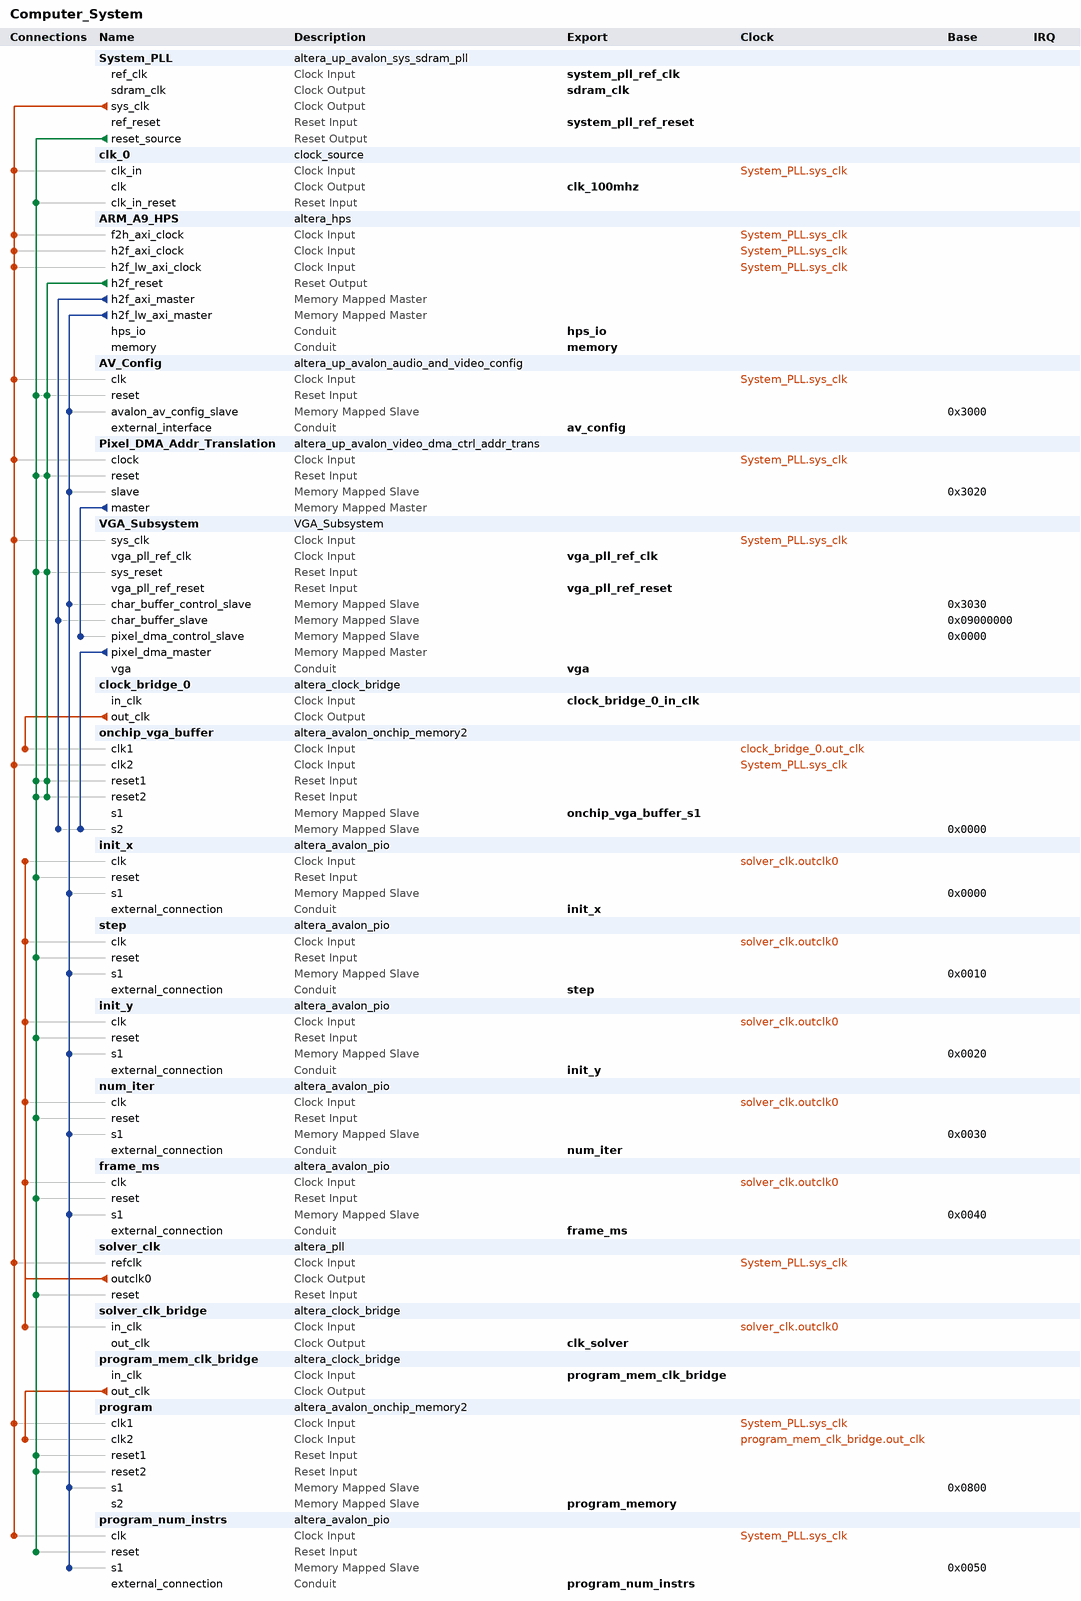
[diagram p0: system contents]
# Platform Designer (Qsys) system Computer_System, Cyclone V 5CSEMA5F31C6
# Parameters at their usual value, and those the tool derives, are not listed.
package require -exact qsys 16.1
create_system Computer_System
set_project_property DEVICE_FAMILY {Cyclone V}
set_project_property DEVICE 5CSEMA5F31C6

add_instance System_PLL altera_up_avalon_sys_sdram_pll 16.1
set_instance_parameter_value System_PLL CV_boards DE1-SoC
set_instance_parameter_value System_PLL gui_outclk 100.0
set_instance_parameter_value System_PLL gui_refclk 50.0

add_instance clk_0 clock_source 16.1
set_instance_parameter_value clk_0 clockFrequency 100000000

add_instance ARM_A9_HPS altera_hps 16.1
set_instance_parameter_value ARM_A9_HPS EMAC1_Mode RGMII
set_instance_parameter_value ARM_A9_HPS EMAC1_PinMuxing {HPS I/O Set 0}
set_instance_parameter_value ARM_A9_HPS F2SCLK_COLDRST_Enable false
set_instance_parameter_value ARM_A9_HPS F2SCLK_DBGRST_Enable false
set_instance_parameter_value ARM_A9_HPS F2SCLK_WARMRST_Enable false
set_instance_parameter_value ARM_A9_HPS F2SINTERRUPT_Enable true
set_instance_parameter_value ARM_A9_HPS F2S_Width 2
set_instance_parameter_value ARM_A9_HPS FPGA_PERIPHERAL_OUTPUT_CLOCK_FREQ_EMAC0_GTX_CLK 125
set_instance_parameter_value ARM_A9_HPS FPGA_PERIPHERAL_OUTPUT_CLOCK_FREQ_EMAC0_MD_CLK 100.0
set_instance_parameter_value ARM_A9_HPS FPGA_PERIPHERAL_OUTPUT_CLOCK_FREQ_EMAC1_GTX_CLK 125
set_instance_parameter_value ARM_A9_HPS FPGA_PERIPHERAL_OUTPUT_CLOCK_FREQ_EMAC1_MD_CLK 100.0
set_instance_parameter_value ARM_A9_HPS HPS_PROTOCOL DDR3
set_instance_parameter_value ARM_A9_HPS I2C0_Mode I2C
set_instance_parameter_value ARM_A9_HPS I2C0_PinMuxing {HPS I/O Set 0}
set_instance_parameter_value ARM_A9_HPS I2C1_Mode I2C
set_instance_parameter_value ARM_A9_HPS I2C1_PinMuxing {HPS I/O Set 0}
set_instance_parameter_value ARM_A9_HPS LWH2F_Enable true
set_instance_parameter_value ARM_A9_HPS MEM_BANKADDR_WIDTH 3
set_instance_parameter_value ARM_A9_HPS MEM_CLK_FREQ 400.0
set_instance_parameter_value ARM_A9_HPS MEM_COL_ADDR_WIDTH 10
set_instance_parameter_value ARM_A9_HPS MEM_DQ_WIDTH 32
set_instance_parameter_value ARM_A9_HPS MEM_DRV_STR RZQ/7
set_instance_parameter_value ARM_A9_HPS MEM_ROW_ADDR_WIDTH 15
set_instance_parameter_value ARM_A9_HPS MEM_RTT_NOM RZQ/4
set_instance_parameter_value ARM_A9_HPS MEM_RTT_WR RZQ/4
set_instance_parameter_value ARM_A9_HPS MEM_TCL 11
set_instance_parameter_value ARM_A9_HPS MEM_TFAW_NS 30.0
set_instance_parameter_value ARM_A9_HPS MEM_TRAS_NS 35.0
set_instance_parameter_value ARM_A9_HPS MEM_TRCD_NS 13.75
set_instance_parameter_value ARM_A9_HPS MEM_TRFC_NS 260.0
set_instance_parameter_value ARM_A9_HPS MEM_TRP_NS 13.75
set_instance_parameter_value ARM_A9_HPS MEM_VENDOR JEDEC
set_instance_parameter_value ARM_A9_HPS MEM_WTCL 8
set_instance_parameter_value ARM_A9_HPS QSPI_Mode {1 SS}
set_instance_parameter_value ARM_A9_HPS QSPI_PinMuxing {HPS I/O Set 0}
set_instance_parameter_value ARM_A9_HPS REF_CLK_FREQ 25.0
set_instance_parameter_value ARM_A9_HPS S2FCLK_USER2CLK 5
set_instance_parameter_value ARM_A9_HPS S2F_Width 3
set_instance_parameter_value ARM_A9_HPS SDIO_Mode {4-bit Data}
set_instance_parameter_value ARM_A9_HPS SDIO_PinMuxing {HPS I/O Set 0}
set_instance_parameter_value ARM_A9_HPS SPIM1_Mode {Single Slave Select}
set_instance_parameter_value ARM_A9_HPS SPIM1_PinMuxing {HPS I/O Set 0}
set_instance_parameter_value ARM_A9_HPS STM_Enable false
set_instance_parameter_value ARM_A9_HPS TIMING_BOARD_AC_SKEW 0.03
set_instance_parameter_value ARM_A9_HPS TIMING_BOARD_AC_TO_CK_SKEW 0.0
set_instance_parameter_value ARM_A9_HPS TIMING_BOARD_DQ_TO_DQS_SKEW 0.0
set_instance_parameter_value ARM_A9_HPS TIMING_BOARD_MAX_CK_DELAY 0.03
set_instance_parameter_value ARM_A9_HPS TIMING_BOARD_MAX_DQS_DELAY 0.02
set_instance_parameter_value ARM_A9_HPS TIMING_BOARD_SKEW_BETWEEN_DQS 0.08
set_instance_parameter_value ARM_A9_HPS TIMING_BOARD_SKEW_CKDQS_DIMM_MAX 0.16
set_instance_parameter_value ARM_A9_HPS TIMING_BOARD_SKEW_CKDQS_DIMM_MIN 0.09
set_instance_parameter_value ARM_A9_HPS TIMING_BOARD_SKEW_WITHIN_DQS 0.01
set_instance_parameter_value ARM_A9_HPS TIMING_TDH 65
set_instance_parameter_value ARM_A9_HPS TIMING_TDQSCK 255
set_instance_parameter_value ARM_A9_HPS TIMING_TDQSQ 125
set_instance_parameter_value ARM_A9_HPS TIMING_TDS 30
set_instance_parameter_value ARM_A9_HPS TIMING_TIH 140
set_instance_parameter_value ARM_A9_HPS TIMING_TIS 180
set_instance_parameter_value ARM_A9_HPS TIMING_TQSH 0.4
set_instance_parameter_value ARM_A9_HPS UART0_Mode {No Flow Control}
set_instance_parameter_value ARM_A9_HPS UART0_PinMuxing {HPS I/O Set 0}
set_instance_parameter_value ARM_A9_HPS USB1_Mode SDR
set_instance_parameter_value ARM_A9_HPS USB1_PinMuxing {HPS I/O Set 0}
set_instance_parameter_value ARM_A9_HPS desired_cfg_clk_mhz 100.0
set_instance_parameter_value ARM_A9_HPS desired_qspi_clk_mhz 400.0

add_instance AV_Config altera_up_avalon_audio_and_video_config 16.1
set_instance_parameter_value AV_Config audio_in {Microphone to ADC}
set_instance_parameter_value AV_Config bit_length 32
set_instance_parameter_value AV_Config board DE1-SoC
set_instance_parameter_value AV_Config line_in_bypass false
set_instance_parameter_value AV_Config sampling_rate {48 kHz}

add_instance Pixel_DMA_Addr_Translation altera_up_avalon_video_dma_ctrl_addr_trans 16.1

add_instance VGA_Subsystem VGA_Subsystem 1.0

add_instance clock_bridge_0 altera_clock_bridge 16.1
set_instance_parameter_value clock_bridge_0 DERIVED_CLOCK_RATE 0
set_instance_parameter_value clock_bridge_0 EXPLICIT_CLOCK_RATE 100000000

add_instance onchip_vga_buffer altera_avalon_onchip_memory2 16.1
set_instance_parameter_value onchip_vga_buffer dataWidth 8
set_instance_parameter_value onchip_vga_buffer dualPort true
set_instance_parameter_value onchip_vga_buffer initMemContent false
set_instance_parameter_value onchip_vga_buffer initializationFileName onchip_mem.hex
set_instance_parameter_value onchip_vga_buffer memorySize 307200

add_instance init_x altera_avalon_pio 16.1
set_instance_parameter_value init_x direction Output
set_instance_parameter_value init_x resetValue 100663296
set_instance_parameter_value init_x width 27

add_instance step altera_avalon_pio 16.1
set_instance_parameter_value step direction Output
set_instance_parameter_value step resetValue 31195136
set_instance_parameter_value step width 27

add_instance init_y altera_avalon_pio 16.1
set_instance_parameter_value init_y direction Output
set_instance_parameter_value init_y resetValue 100401152
set_instance_parameter_value init_y width 27

add_instance num_iter altera_avalon_pio 16.1
set_instance_parameter_value num_iter direction Output
set_instance_parameter_value num_iter resetValue 1000
set_instance_parameter_value num_iter width 10

add_instance frame_ms altera_avalon_pio 16.1
set_instance_parameter_value frame_ms direction Input
set_instance_parameter_value frame_ms width 32

add_instance solver_clk altera_pll 16.1
set_instance_parameter_value solver_clk gui_device_speed_grade 1
set_instance_parameter_value solver_clk gui_number_of_clocks 1
set_instance_parameter_value solver_clk gui_operation_mode direct
set_instance_parameter_value solver_clk gui_output_clock_frequency0 50.0
set_instance_parameter_value solver_clk gui_pll_mode {Integer-N PLL}
set_instance_parameter_value solver_clk gui_reference_clock_frequency 100.0
set_instance_parameter_value solver_clk gui_use_locked false

add_instance solver_clk_bridge altera_clock_bridge 16.1
set_instance_parameter_value solver_clk_bridge DERIVED_CLOCK_RATE 50000000
set_instance_parameter_value solver_clk_bridge EXPLICIT_CLOCK_RATE 50000000

add_instance program_mem_clk_bridge altera_clock_bridge 16.1
set_instance_parameter_value program_mem_clk_bridge DERIVED_CLOCK_RATE 0
set_instance_parameter_value program_mem_clk_bridge EXPLICIT_CLOCK_RATE 100000000

add_instance program altera_avalon_onchip_memory2 16.1
set_instance_parameter_value program dataWidth 128
set_instance_parameter_value program dualPort true
set_instance_parameter_value program initMemContent true
set_instance_parameter_value program initializationFileName onchip_mem.hex
set_instance_parameter_value program memorySize 1500

add_instance program_num_instrs altera_avalon_pio 16.1
set_instance_parameter_value program_num_instrs direction Input
set_instance_parameter_value program_num_instrs width 32

# connections
add_connection clock_bridge_0.out_clk onchip_vga_buffer.clk1 clock
add_connection program_mem_clk_bridge.out_clk program.clk2 clock
add_connection solver_clk.outclk0 frame_ms.clk clock
add_connection solver_clk.outclk0 init_x.clk clock
add_connection solver_clk.outclk0 init_y.clk clock
add_connection solver_clk.outclk0 num_iter.clk clock
add_connection solver_clk.outclk0 solver_clk_bridge.in_clk clock
add_connection solver_clk.outclk0 step.clk clock
add_connection System_PLL.sys_clk ARM_A9_HPS.f2h_axi_clock clock
add_connection System_PLL.sys_clk ARM_A9_HPS.h2f_axi_clock clock
add_connection System_PLL.sys_clk ARM_A9_HPS.h2f_lw_axi_clock clock
add_connection System_PLL.sys_clk AV_Config.clk clock
add_connection System_PLL.sys_clk clk_0.clk_in clock
add_connection System_PLL.sys_clk onchip_vga_buffer.clk2 clock
add_connection System_PLL.sys_clk Pixel_DMA_Addr_Translation.clock clock
add_connection System_PLL.sys_clk program.clk1 clock
add_connection System_PLL.sys_clk program_num_instrs.clk clock
add_connection System_PLL.sys_clk solver_clk.refclk clock
add_connection System_PLL.sys_clk VGA_Subsystem.sys_clk clock
add_connection ARM_A9_HPS.h2f_reset AV_Config.reset reset
add_connection ARM_A9_HPS.h2f_reset onchip_vga_buffer.reset1 reset
add_connection ARM_A9_HPS.h2f_reset onchip_vga_buffer.reset2 reset
add_connection ARM_A9_HPS.h2f_reset Pixel_DMA_Addr_Translation.reset reset
add_connection ARM_A9_HPS.h2f_reset VGA_Subsystem.sys_reset reset
add_connection System_PLL.reset_source AV_Config.reset reset
add_connection System_PLL.reset_source clk_0.clk_in_reset reset
add_connection System_PLL.reset_source frame_ms.reset reset
add_connection System_PLL.reset_source init_x.reset reset
add_connection System_PLL.reset_source init_y.reset reset
add_connection System_PLL.reset_source num_iter.reset reset
add_connection System_PLL.reset_source onchip_vga_buffer.reset1 reset
add_connection System_PLL.reset_source onchip_vga_buffer.reset2 reset
add_connection System_PLL.reset_source Pixel_DMA_Addr_Translation.reset reset
add_connection System_PLL.reset_source program.reset1 reset
add_connection System_PLL.reset_source program.reset2 reset
add_connection System_PLL.reset_source program_num_instrs.reset reset
add_connection System_PLL.reset_source solver_clk.reset reset
add_connection System_PLL.reset_source step.reset reset
add_connection System_PLL.reset_source VGA_Subsystem.sys_reset reset
add_connection ARM_A9_HPS.h2f_axi_master onchip_vga_buffer.s2 avalon
set_connection_parameter_value ARM_A9_HPS.h2f_axi_master/onchip_vga_buffer.s2 baseAddress 0x0000
add_connection ARM_A9_HPS.h2f_axi_master VGA_Subsystem.char_buffer_slave avalon
set_connection_parameter_value ARM_A9_HPS.h2f_axi_master/VGA_Subsystem.char_buffer_slave baseAddress 0x09000000
add_connection ARM_A9_HPS.h2f_lw_axi_master AV_Config.avalon_av_config_slave avalon
set_connection_parameter_value ARM_A9_HPS.h2f_lw_axi_master/AV_Config.avalon_av_config_slave baseAddress 0x3000
add_connection ARM_A9_HPS.h2f_lw_axi_master frame_ms.s1 avalon
set_connection_parameter_value ARM_A9_HPS.h2f_lw_axi_master/frame_ms.s1 baseAddress 0x0040
add_connection ARM_A9_HPS.h2f_lw_axi_master init_x.s1 avalon
set_connection_parameter_value ARM_A9_HPS.h2f_lw_axi_master/init_x.s1 baseAddress 0x0000
add_connection ARM_A9_HPS.h2f_lw_axi_master init_y.s1 avalon
set_connection_parameter_value ARM_A9_HPS.h2f_lw_axi_master/init_y.s1 baseAddress 0x0020
add_connection ARM_A9_HPS.h2f_lw_axi_master num_iter.s1 avalon
set_connection_parameter_value ARM_A9_HPS.h2f_lw_axi_master/num_iter.s1 baseAddress 0x0030
add_connection ARM_A9_HPS.h2f_lw_axi_master Pixel_DMA_Addr_Translation.slave avalon
set_connection_parameter_value ARM_A9_HPS.h2f_lw_axi_master/Pixel_DMA_Addr_Translation.slave baseAddress 0x3020
add_connection ARM_A9_HPS.h2f_lw_axi_master program.s1 avalon
set_connection_parameter_value ARM_A9_HPS.h2f_lw_axi_master/program.s1 baseAddress 0x0800
add_connection ARM_A9_HPS.h2f_lw_axi_master program_num_instrs.s1 avalon
set_connection_parameter_value ARM_A9_HPS.h2f_lw_axi_master/program_num_instrs.s1 baseAddress 0x0050
add_connection ARM_A9_HPS.h2f_lw_axi_master step.s1 avalon
set_connection_parameter_value ARM_A9_HPS.h2f_lw_axi_master/step.s1 baseAddress 0x0010
add_connection ARM_A9_HPS.h2f_lw_axi_master VGA_Subsystem.char_buffer_control_slave avalon
set_connection_parameter_value ARM_A9_HPS.h2f_lw_axi_master/VGA_Subsystem.char_buffer_control_slave baseAddress 0x3030
add_connection Pixel_DMA_Addr_Translation.master VGA_Subsystem.pixel_dma_control_slave avalon
set_connection_parameter_value Pixel_DMA_Addr_Translation.master/VGA_Subsystem.pixel_dma_control_slave baseAddress 0x0000
add_connection VGA_Subsystem.pixel_dma_master onchip_vga_buffer.s2 avalon
set_connection_parameter_value VGA_Subsystem.pixel_dma_master/onchip_vga_buffer.s2 baseAddress 0x0000

# exported interfaces
add_interface av_config conduit end
set_interface_property av_config EXPORT_OF AV_Config.external_interface
add_interface clk_100mhz clock source
set_interface_property clk_100mhz EXPORT_OF clk_0.clk
add_interface clk_solver clock source
set_interface_property clk_solver EXPORT_OF solver_clk_bridge.out_clk
add_interface clock_bridge_0_in_clk clock sink
set_interface_property clock_bridge_0_in_clk EXPORT_OF clock_bridge_0.in_clk
add_interface frame_ms conduit end
set_interface_property frame_ms EXPORT_OF frame_ms.external_connection
add_interface hps_io conduit end
set_interface_property hps_io EXPORT_OF ARM_A9_HPS.hps_io
add_interface init_x conduit end
set_interface_property init_x EXPORT_OF init_x.external_connection
add_interface init_y conduit end
set_interface_property init_y EXPORT_OF init_y.external_connection
add_interface memory conduit end
set_interface_property memory EXPORT_OF ARM_A9_HPS.memory
add_interface num_iter conduit end
set_interface_property num_iter EXPORT_OF num_iter.external_connection
add_interface onchip_vga_buffer_s1 avalon slave
set_interface_property onchip_vga_buffer_s1 EXPORT_OF onchip_vga_buffer.s1
add_interface program_mem_clk_bridge clock sink
set_interface_property program_mem_clk_bridge EXPORT_OF program_mem_clk_bridge.in_clk
add_interface program_memory avalon slave
set_interface_property program_memory EXPORT_OF program.s2
add_interface program_num_instrs conduit end
set_interface_property program_num_instrs EXPORT_OF program_num_instrs.external_connection
add_interface sdram_clk clock source
set_interface_property sdram_clk EXPORT_OF System_PLL.sdram_clk
add_interface step conduit end
set_interface_property step EXPORT_OF step.external_connection
add_interface system_pll_ref_clk clock sink
set_interface_property system_pll_ref_clk EXPORT_OF System_PLL.ref_clk
add_interface system_pll_ref_reset reset sink
set_interface_property system_pll_ref_reset EXPORT_OF System_PLL.ref_reset
add_interface vga conduit end
set_interface_property vga EXPORT_OF VGA_Subsystem.vga
add_interface vga_pll_ref_clk clock sink
set_interface_property vga_pll_ref_clk EXPORT_OF VGA_Subsystem.vga_pll_ref_clk
add_interface vga_pll_ref_reset reset sink
set_interface_property vga_pll_ref_reset EXPORT_OF VGA_Subsystem.vga_pll_ref_reset

set_interconnect_requirement {$system} qsys_mm.clockCrossingAdapter HANDSHAKE
set_interconnect_requirement {$system} qsys_mm.enableEccProtection FALSE
set_interconnect_requirement {$system} qsys_mm.insertDefaultSlave FALSE
set_interconnect_requirement {$system} qsys_mm.maxAdditionalLatency 1

save_system Computer_System.qsys
